# Altium schematic sheet Connectors.SchDoc
size A4; SheetNumber: 3; SheetTotal: 3
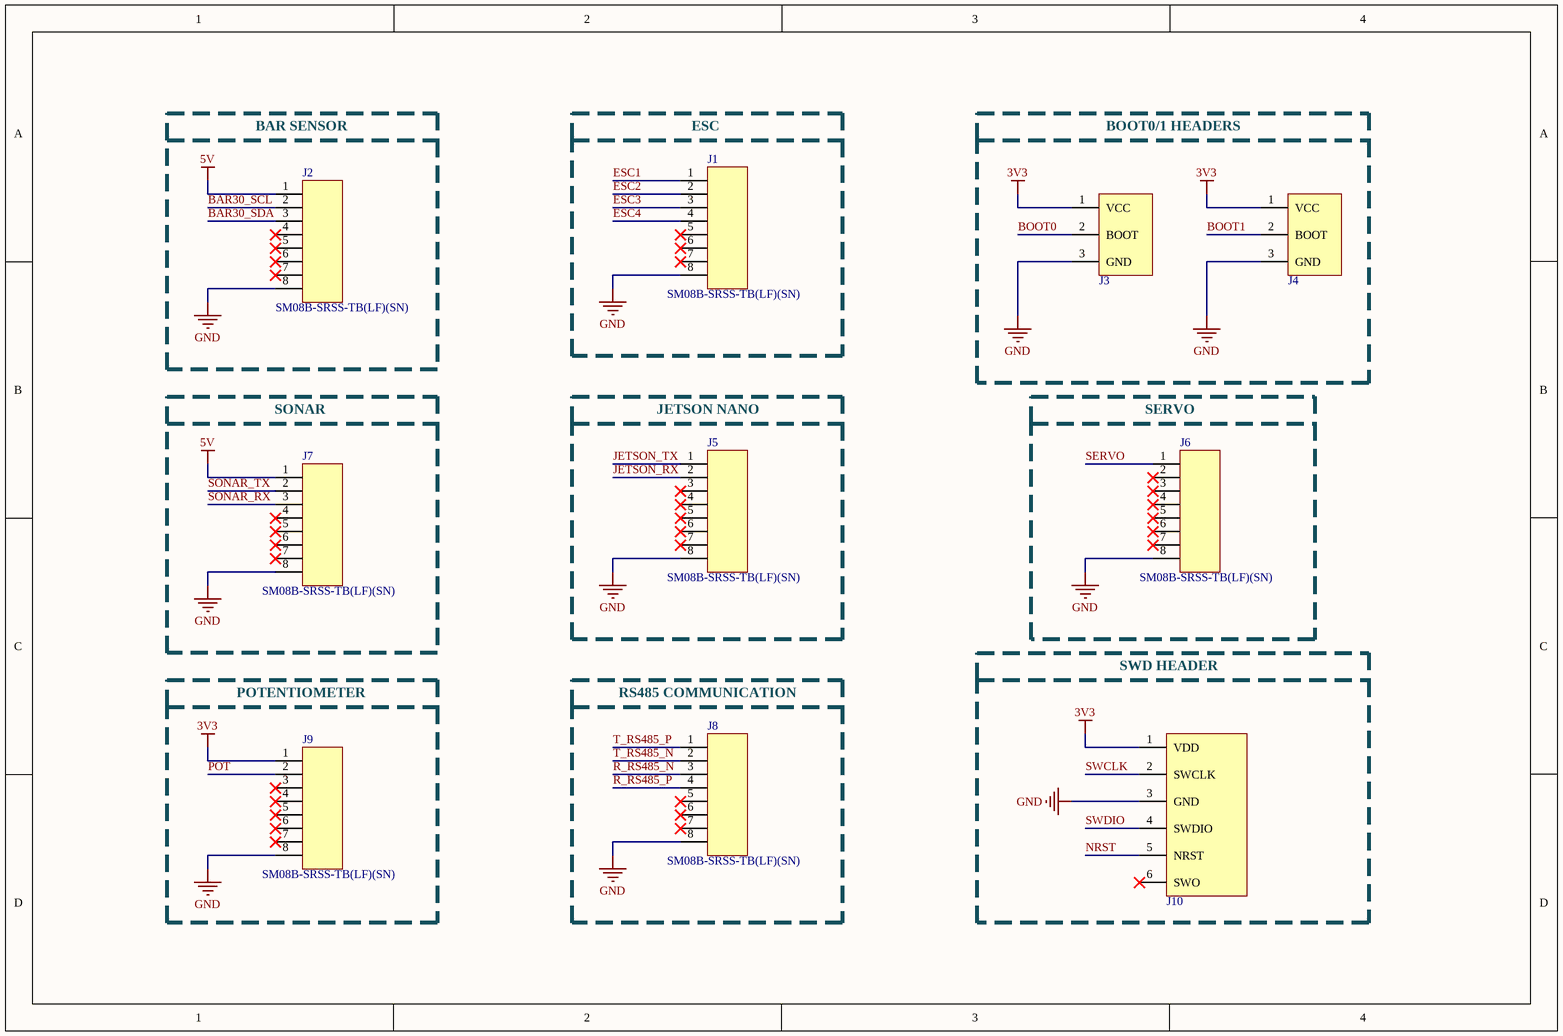
[diagram p0: Connectors.SchDoc]

## Parts
J1  SM08B-SRSS-TB(LF)(SN)  [8 PIN HEADER]
J2  SM08B-SRSS-TB(LF)(SN)  [8 PIN HEADER]
J3  61300311121  [BOOT HEADER]  (value not drawn)
J4  61300311121  [BOOT HEADER]  (value not drawn)
J5  SM08B-SRSS-TB(LF)(SN)  [8 PIN HEADER]
J6  SM08B-SRSS-TB(LF)(SN)  [8 PIN HEADER]
J7  SM08B-SRSS-TB(LF)(SN)  [8 PIN HEADER]
J8  SM08B-SRSS-TB(LF)(SN)  [8 PIN HEADER]
J9  SM08B-SRSS-TB(LF)(SN)  [8 PIN HEADER]
J10  61300611121  [SWD HEADER]  (value not drawn)

## Blocks framed on the sheet
BAR SENSOR: J2
ESC: J1
BOOT0/1 HEADERS: J3 J4
SONAR: J7
JETSON NANO: J5
SERVO: J6
POTENTIOMETER: J9
RS485 COMMUNICATION: J8
SWD HEADER: J10

## Nets
3V3: J3.1(VCC) J4.1(VCC) J9.1 J10.1(VDD)
5V: J2.1 J7.1
GND: J1.8 J2.8 J3.3(GND) J4.3(GND) J5.8 J6.8 J7.8 J8.8 J9.8 J10.3(GND)
BAR30_SCL: J2.2
BAR30_SDA: J2.3
BOOT0: J3.2(BOOT)
BOOT1: J4.2(BOOT)
ESC1: J1.1
ESC2: J1.2
ESC3: J1.3
ESC4: J1.4
JETSON_RX: J5.2
JETSON_TX: J5.1
NRST: J10.5(NRST)
POT: J9.2
R_RS485_N: J8.3
R_RS485_P: J8.4
SERVO: J6.1
SONAR_RX: J7.3
SONAR_TX: J7.2
SWCLK: J10.2(SWCLK)
SWDIO: J10.4(SWDIO)
T_RS485_N: J8.2
T_RS485_P: J8.1

Not connected (* = marked no-connect by the designer): J1 5* 6* 7*; J2 4* 5* 6* 7*; J5 3* 4* 5* 6* 7*; J6 2* 3* 4* 5* 6* 7*; J7 4* 5* 6* 7*; J8 5* 6* 7*; J9 3* 4* 5* 6* 7*; J10 6(SWO)*

## Library data of the parts
J1 J2 J5-J9 = SM08B-SRSS-TB(LF)(SN): Connector Header, Side Entry, SR Series, 8 Position, 1.00mm, 50V, Surface Mount, Tin, Natural; Manufacturer: JST; Designed by: ADAK; Supplier 1: Farnell; Manufacturer Part Number: SM08B-SRSS-TB(LF)(SN); RoHS: Yes; Category: Connectors; Stock 1: 77890; Pricing 1: 10=0,776, 100=0,639, 500=0,522, 1000=0,464, 2500=0,443, 5000=0,421 (EUR); ComponentLink1URL: https://datasheet.ciiva.com/11752/0900766b8082f54b-11752174.pdf?src-supplier=Rs; ComponentLink1Description: https://datasheet.ciiva.com/11752/0900766b8082f54b-11752174.pdf?src-supplier=Rs; ComponentLink2URL: https://datasheet.ciiva.com/8052/91630-8052285.pdf?src-supplier=Element14; ComponentLink2Description: https://datasheet.ciiva.com/8052/91630-8052285.pdf?src-supplier=Element14; ComponentLink3URL: https://datasheet.ciiva.com/729/esr-729838.pdf?src-supplier=Digi-Key; ComponentLink3Description: https://datasheet.ciiva.com/729/esr-729838.pdf?src-supplier=Digi-Key; ComponentLink4URL: https://datasheet.ciiva.com/712/esr-712599.pdf?src-supplier=Digi-Key; ComponentLink4Description: https://datasheet.ciiva.com/712/esr-712599.pdf?src-supplier=Digi-Key; ComponentLink5URL: https://datasheet.ciiva.com/712/esr-712600.pdf?src-supplier=Digi-Key; ComponentLink5Description: https://datasheet.ciiva.com/712/esr-712600.pdf?src-supplier=Digi-Key; ComponentLink6URL: https://datasheet.ciiva.com/16487/esr-16487087.pdf?src-supplier=Future+Electronics; ComponentLink6Description: https://datasheet.ciiva.com/16487/esr-16487087.pdf?src-supplier=Future+Electronics; Supplier Part Number 1: 1679124
J3 J4 = 61300311121: CONN HEADER VERT 3POS 2.54MM; Manufacturer: Wurth Electronics; Number of Positions: 3; Gender: Male; Pitch: 0.1inch; Designed by: ADAK; Supplier 1: Digi-Key; Manufacturer Part Number: 61300311121; RoHS: Yes; Category: Connectors; Stock 1: 116212; Pricing 1: 1=0,13, 10=0,113, 25=0,094, 50=0,079, 100=0,071, 1000=0,066 (USD); Mount: Through Hole; Contact Plating: Gold; Contact Material: Copper; Color: Black; Number of Rows: 1; Packaging: Bulk; Termination: Solder; Number of Contacts: 3; Series: WR-PHD; Contact Type: Male Pin; Contact Mating Length: 0.236inch; Lead Free: Lead Free; RoHS Compliant: Yes; Reach SVHC Compliant: Unknown; ComponentLink1URL: http://www.farnell.com/cad/1737268.pdf?src-supplier=Element14; ComponentLink1Description: http://www.farnell.com/cad/1737268.pdf?src-supplier=Element14; ComponentLink2URL: https://datasheet.octopart.com/61300311121-W%C3%BCrth-Elektronik-datasheet-21154836.pdf?src-supplier=Element14; ComponentLink2Description: https://datasheet.octopart.com/61300311121-W%C3%BCrth-Elektronik-datasheet-21154836.pdf?src-supplier=Element14; ComponentLink3URL: https://katalog.we-online.de/em/datasheet/6130xx11121.pdf?src-supplier=Digi-Key; ComponentLink3Description: https://katalog.we-online.de/em/datasheet/6130xx11121.pdf?src-supplier=Digi-Key; Supplier Part Number 1: 732-5316-ND
J10 = 61300611121: CONN HEADER VERT 6POS 2.54MM; Manufacturer: Wurth Electronics; Current Rating: 3A; Voltage Rating: 250V; Number of Positions: 6; Gender: Male; Pitch: 0.1inch; Designed by: ADAK; Supplier 1: Digi-Key; Manufacturer Part Number: 61300611121; RoHS: Yes; Category: Headers and Wire Housings; Stock 1: 10537; Pricing 1: 1=0,35, 10=0,298, 25=0,2472, 50=0,207, 100=0,187, 1000=0,171 (USD); Mount: Through Hole; Contact Plating: Gold; Contact Material: Copper Alloy,Copper; Housing Material: PBT; Color: Black; Min Operating Temperature: -40°C; Max Operating Temperature: 125°C; Number of Rows: 1; Contact Gender: Male; Packaging: Bulk; Termination: Through Hole; Number of Contacts: 6; Series: WR-PHD; Contact Type: Male Pin; Contact Mating Length: 0.236inch; Lead Free: Lead Free; RoHS Compliant: Yes; Reach SVHC Compliant: Unknown; ComponentLink1URL: http://www.mouser.com/ds/2/445/6130xx11121-538006.pdf?src-supplier=Mouser; ComponentLink1Description: http://www.mouser.com/ds/2/445/6130xx11121-538006.pdf?src-supplier=Mouser; ComponentLink2URL: http://www.farnell.com/cad/1737268.pdf?src-supplier=Element14; ComponentLink2Description: http://www.farnell.com/cad/1737268.pdf?src-supplier=Element14; ComponentLink3URL: https://datasheet.octopart.com/61300611121-W%C3%BCrth-Elektronik-datasheet-21154836.pdf?src-supplier=Element14; ComponentLink3Description: https://datasheet.octopart.com/61300611121-W%C3%BCrth-Elektronik-datasheet-21154836.pdf?src-supplier=Element14; ComponentLink4URL: https://katalog.we-online.de/em/datasheet/6130xx11121.pdf?src-supplier=Digi-Key; ComponentLink4Description: https://katalog.we-online.de/em/datasheet/6130xx11121.pdf?src-supplier=Digi-Key; Supplier Part Number 1: 732-5319-ND